# Altium schematic sheet CONNECTOR.SchDoc
size A3
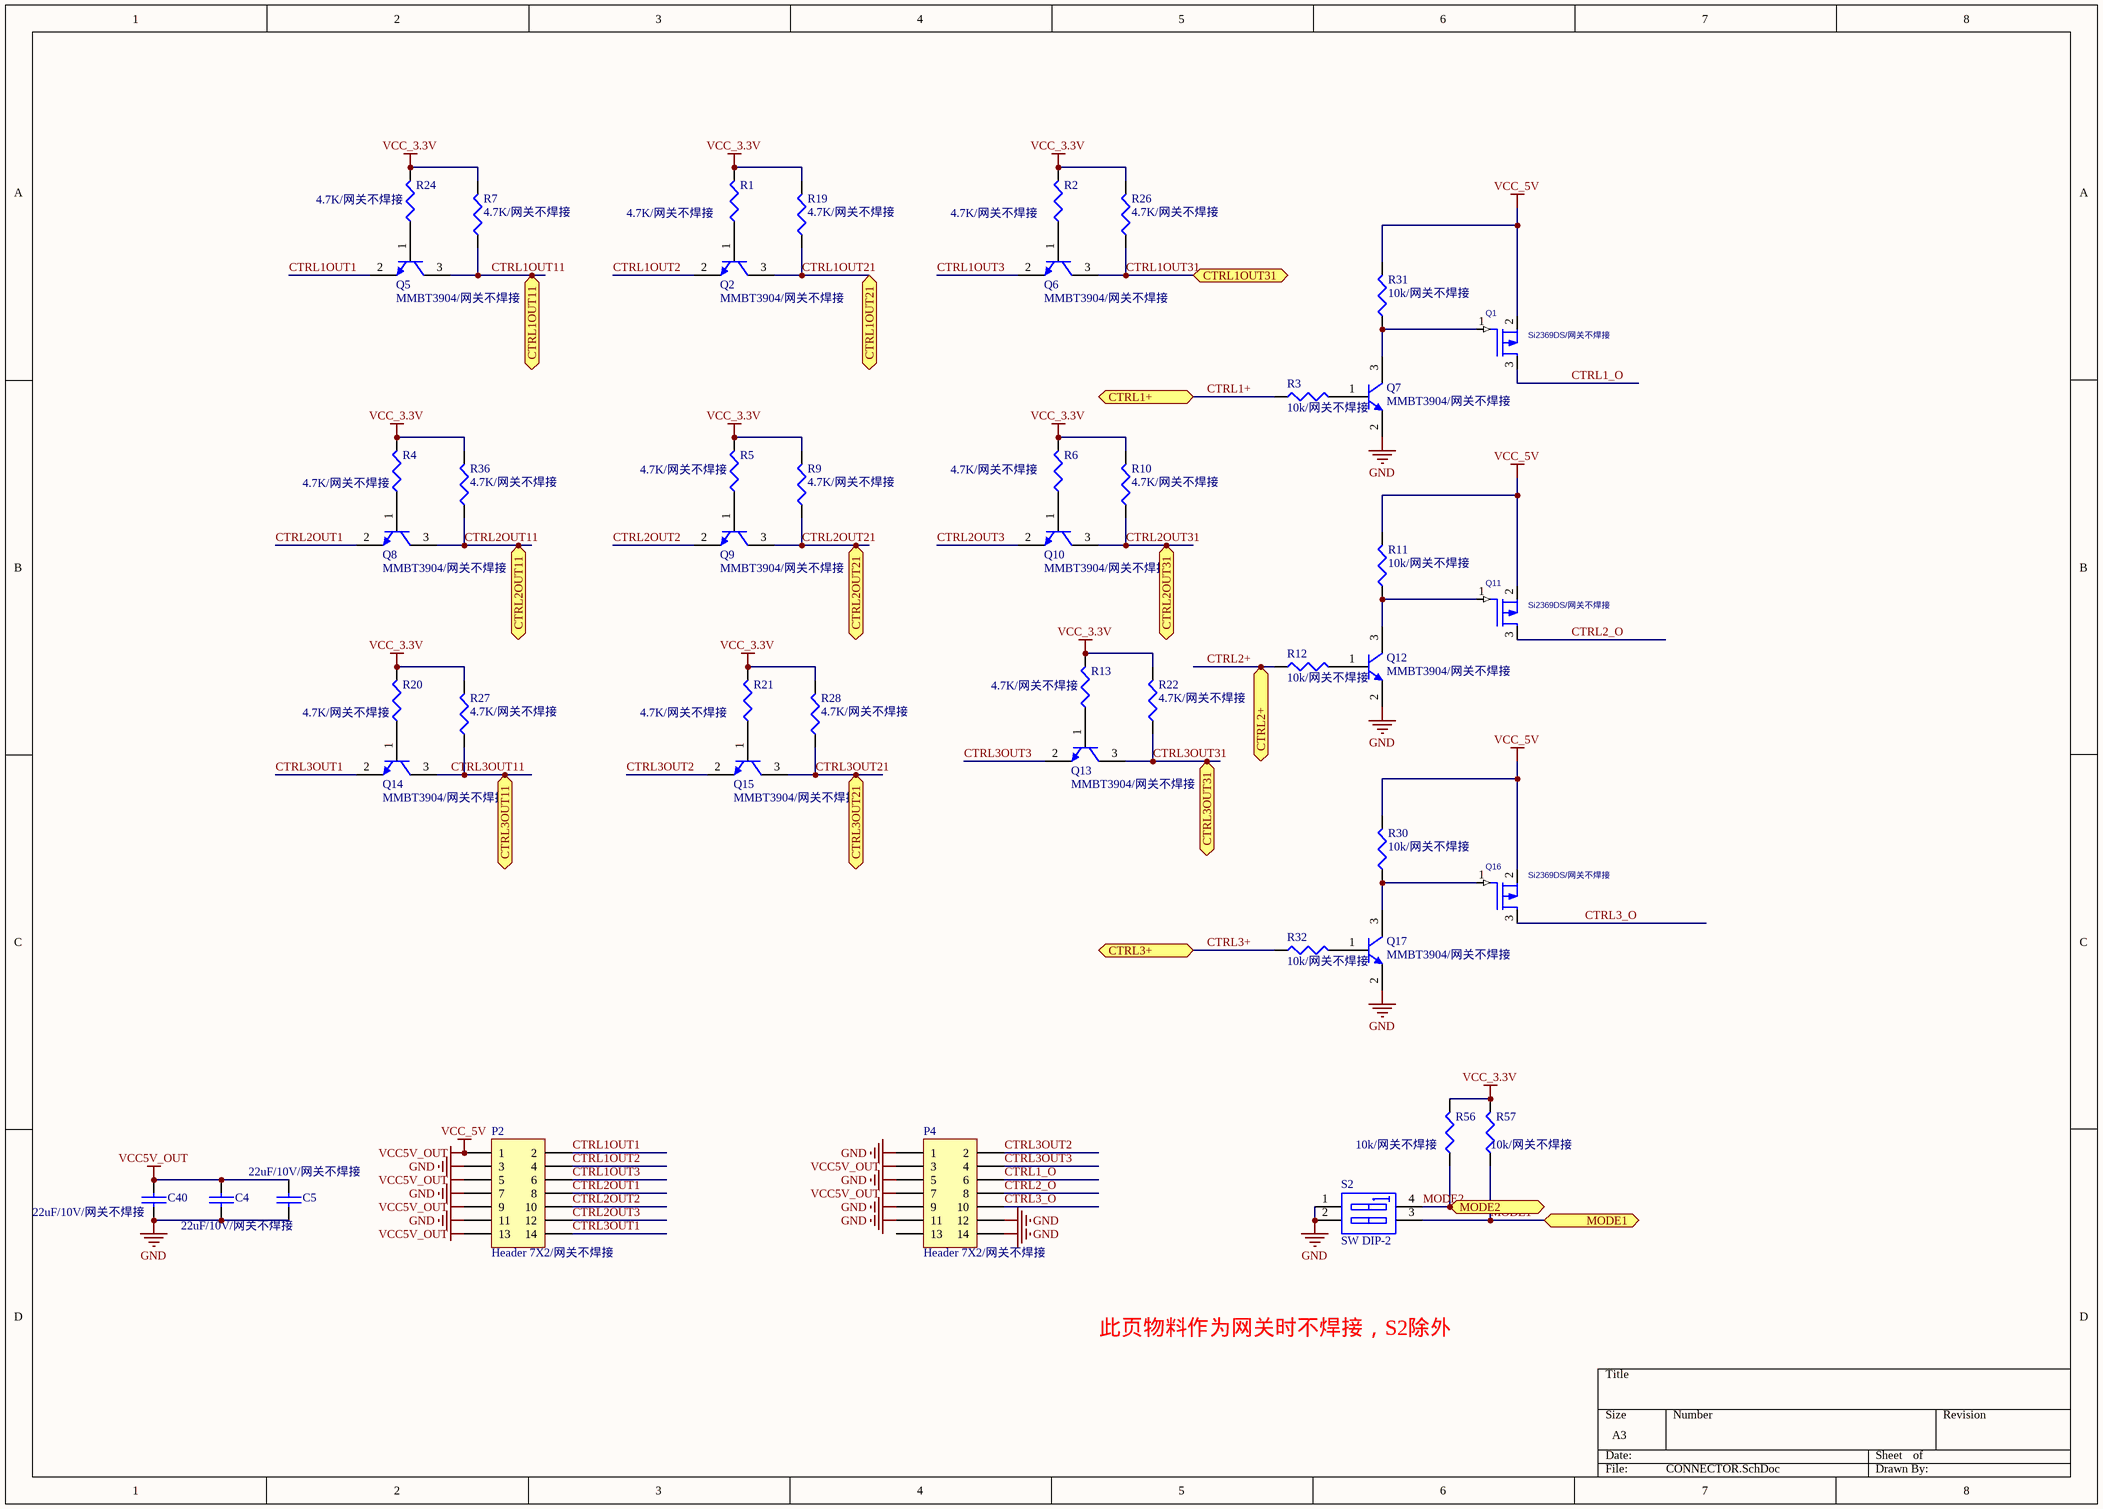
[diagram p0: CONNECTOR.SchDoc]

## Parts
C4  22uF/10V/网关不焊接  [1206C]
C5  22uF/10V/网关不焊接  [1206C]
C40  22uF/10V/网关不焊接  [1206C]
P2  Header 7X2/网关不焊接  [14X2.54MMZ]
P4  Header 7X2/网关不焊接  [14X2.54MMZ]
Q1  Si2369DS/网关不焊接  [SOT23]
Q2  MMBT3904/网关不焊接  [SOT23-3]
Q5  MMBT3904/网关不焊接  [SOT23-3]
Q6  MMBT3904/网关不焊接  [SOT23-3]
Q7  MMBT3904/网关不焊接  [SOT23-3]
Q8  MMBT3904/网关不焊接  [SOT23-3]
Q9  MMBT3904/网关不焊接  [SOT23-3]
Q10  MMBT3904/网关不焊接  [SOT23-3]
Q11  Si2369DS/网关不焊接  [SOT23]
Q12  MMBT3904/网关不焊接  [SOT23-3]
Q13  MMBT3904/网关不焊接  [SOT23-3]
Q14  MMBT3904/网关不焊接  [SOT23-3]
Q15  MMBT3904/网关不焊接  [SOT23-3]
Q16  Si2369DS/网关不焊接  [SOT23]
Q17  MMBT3904/网关不焊接  [SOT23-3]
R1  4.7K/网关不焊接  [0603R]
R2  4.7K/网关不焊接  [0603R]
R3  10k/网关不焊接  [0603R]
R4  4.7K/网关不焊接  [0603R]
R5  4.7K/网关不焊接  [0603R]
R6  4.7K/网关不焊接  [0603R]
R7  4.7K/网关不焊接  [0603R]
R9  4.7K/网关不焊接  [0603R]
R10  4.7K/网关不焊接  [0603R]
R11  10k/网关不焊接  [0603R]
R12  10k/网关不焊接  [0603R]
R13  4.7K/网关不焊接  [0603R]
R19  4.7K/网关不焊接  [0603R]
R20  4.7K/网关不焊接  [0603R]
R21  4.7K/网关不焊接  [0603R]
R22  4.7K/网关不焊接  [0603R]
R24  4.7K/网关不焊接  [0603R]
R26  4.7K/网关不焊接  [0603R]
R27  4.7K/网关不焊接  [0603R]
R28  4.7K/网关不焊接  [0603R]
R30  10k/网关不焊接  [0603R]
R31  10k/网关不焊接  [0603R]
R32  10k/网关不焊接  [0603R]
R36  4.7K/网关不焊接  [0603R]
R56  10k/网关不焊接  [0603R]
R57  10k/网关不焊接  [0603R]
S2  SW DIP-2  [SW_SMT_4]

## Ports
CTRL1+, CTRL1OUT11, CTRL1OUT21, CTRL1OUT31, CTRL2+, CTRL2OUT11, CTRL2OUT21, CTRL2OUT31, CTRL3+, CTRL3OUT11, CTRL3OUT21, CTRL3OUT31, MODE1, MODE2

## Nets
GND: C4.2 C5.2 C40.2 P2.3 P2.7 P2.11 P4.1 P4.5 P4.9 P4.11 P4.12 P4.14 Q7.2(E) Q12.2(E) Q17.2(E) S2.1(A1) S2.2(A2)
VCC5V_OUT: C4.1 C5.1 C40.1 P2.1 P2.5 P2.9 P2.13 P4.3 P4.7 Q1.2(DRAIN) Q11.2(DRAIN) Q16.2(DRAIN) R11.2 R30.2 R31.2  [also labelled VCC_5V]
VCC_3.3V: R1.2 R2.2 R4.2 R5.2 R6.2 R7.2 R9.2 R10.2 R13.2 R19.2 R20.2 R21.2 R22.2 R24.2 R26.2 R27.2 R28.2 R36.2 R56.2 R57.2
CTRL1+: R3.1 ; port CTRL1+
CTRL1_O: P4.6 Q1.3(SOURCE)
CTRL1OUT1: P2.2 Q5.2(E)
CTRL1OUT2: P2.4 Q2.2(E)
CTRL1OUT3: P2.6 Q6.2(E)
CTRL1OUT11: Q5.3(C) R7.1 ; port CTRL1OUT11
CTRL1OUT21: Q2.3(C) R19.1 ; port CTRL1OUT21
CTRL1OUT31: Q6.3(C) R26.1 ; port CTRL1OUT31
CTRL2+: R12.1 ; port CTRL2+
CTRL2_O: P4.8 Q11.3(SOURCE)
CTRL2OUT1: P2.8 Q8.2(E)
CTRL2OUT2: P2.10 Q9.2(E)
CTRL2OUT3: P2.12 Q10.2(E)
CTRL2OUT11: Q8.3(C) R36.1 ; port CTRL2OUT11
CTRL2OUT21: Q9.3(C) R9.1 ; port CTRL2OUT21
CTRL2OUT31: Q10.3(C) R10.1 ; port CTRL2OUT31
CTRL3+: R32.1 ; port CTRL3+
CTRL3_O: P4.10 Q16.3(SOURCE)
CTRL3OUT1: P2.14 Q14.2(E)
CTRL3OUT2: P4.2 Q15.2(E)
CTRL3OUT3: P4.4 Q13.2(E)
CTRL3OUT11: Q14.3(C) R27.1 ; port CTRL3OUT11
CTRL3OUT21: Q15.3(C) R28.1 ; port CTRL3OUT21
CTRL3OUT31: Q13.3(C) R22.1 ; port CTRL3OUT31
MODE1: R57.1 S2.3(B2) ; port MODE1
MODE2: R56.1 S2.4(B1) ; port MODE2
NetQ1_1: Q1.1(GATE) Q7.3(C) R31.1
NetQ2_1: Q2.1(B) R1.1
NetQ5_1: Q5.1(B) R24.1
NetQ6_1: Q6.1(B) R2.1
NetQ7_1: Q7.1(B) R3.2
NetQ8_1: Q8.1(B) R4.1
NetQ9_1: Q9.1(B) R5.1
NetQ10_1: Q10.1(B) R6.1
NetQ11_1: Q11.1(GATE) Q12.3(C) R11.1
NetQ12_1: Q12.1(B) R12.2
NetQ13_1: Q13.1(B) R13.1
NetQ14_1: Q14.1(B) R20.1
NetQ15_1: Q15.1(B) R21.1
NetQ16_1: Q16.1(GATE) Q17.3(C) R30.1
NetQ17_1: Q17.1(B) R32.2

Not connected (* = marked no-connect by the designer): P4 13

## Notes on the sheet
- 此页物料作为网关时不焊接，S2除外

## Library data of the parts
C4 C5 C40 = CAP: Capacitor
P2 P4 = Header 7X2: Header, 7-Pin, Dual row; LatestRevisionDate: 17-Jul-2002; LatestRevisionNote: Re-released for DXP Platform.; Publisher: Altium Limited
Q1 Q11 Q16 = MOSFET P_1: Color: RGB(255,  0,  0)
Q2 Q5-Q10 Q12-Q15 Q17 = NPN
R1-R7 R9-R13 R19-R22 R24 R26-R28 R30-R32 R36 R56 R57 = RES1: P: 1/8W
S2 = SW DIP-2: DIP Switch, 2 Position, SPST; Published: 24-Mar-1999; LatestRevisionDate: 17-Jul-2002; LatestRevisionNote: Re-released for DXP Platform.; PackageReference: DIP-4; Publisher: Altium Limited